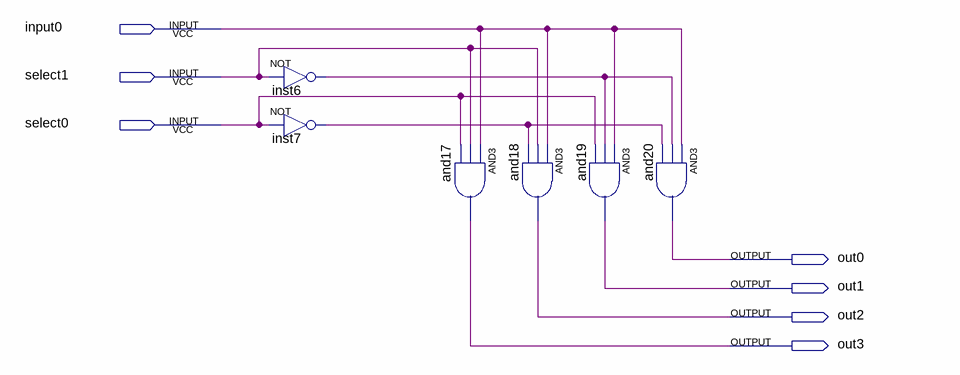
[diagram p0: schematic sheet]
// Quartus schematic DEMUX41.bdf as structural Verilog: 6 symbols, 7 pins
module DEMUX41 (
  input  input0,
  input  select1,
  input  select0,
  output out0,
  output out1,
  output out2,
  output out3
);

  wire inst6_out, inst7_out;

  not inst6 (inst6_out, select1);
  not inst7 (inst7_out, select0);
  and and17 (out3, input0, select1, select0);
  and and18 (out2, input0, select1, inst7_out);
  and and19 (out1, input0, inst6_out, select0);
  and and20 (out0, input0, inst6_out, inst7_out);
endmodule
